# EAGLE design fm-radio (EAGLE 6.5.0)
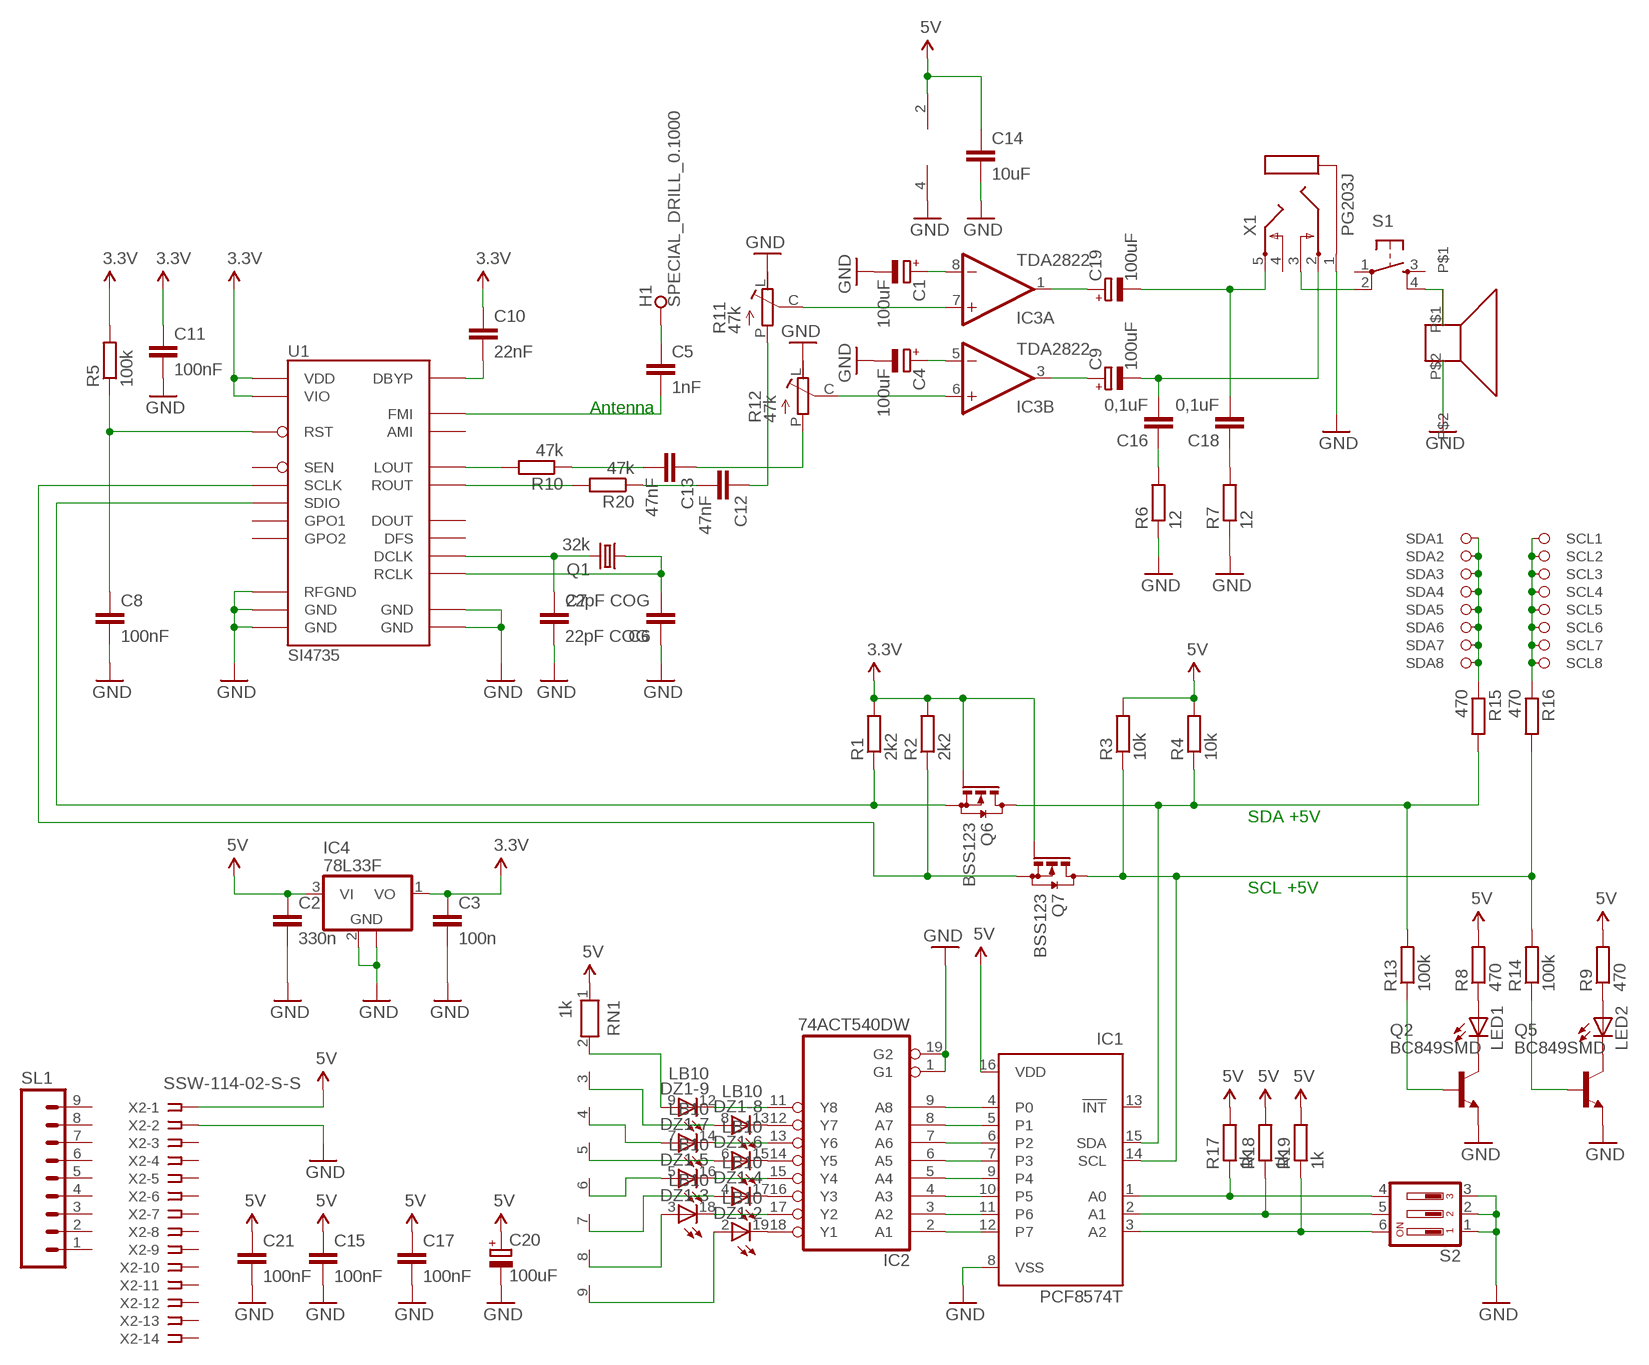
[diagram p0: schematic, sheet 1]

## Parts
C1  100uF  CPOL-EUCT3528  [CT3528]
C2  330n  C-EUC1206  [C1206]
C3  100n  C-EUC1206  [C1206]
C4  100uF  CPOL-EUCT3528  [CT3528]
C5  1nF  C-EUC1206  [C1206]
C6  22pF COG  C-EUC1206  [C1206]
C7  22pF COG  C-EUC1206  [C1206]
C8  100nF  C-EUC1206  [C1206]
C9  100uF  CPOL-EUCT3528  [CT3528]
C10  22nF  C-EUC1206  [C1206]
C11  100nF  C-EUC1206  [C1206]
C12  47nF  C-EUC1206  [C1206]
C13  47nF  C-EUC1206  [C1206]
C14  10uF  C-EUC1206  [C1206]
C15  100nF  C-EUC1206  [C1206]
C16  0,1uF  C-EUC1206  [C1206]
C17  100nF  C-EUC1206  [C1206]
C18  0,1uF  C-EUC1206  [C1206]
C19  100uF  CPOL-EUCT3528  [CT3528]
C20  100uF  CPOL-EUCT3528  [CT3528]
C21  100nF  C-EUC1206  [C1206]
DZ1  LB10  [LB10]
H1  SPECIAL_DRILL_0.1000  [PAD_0.1000]
IC1  PCF8574T  [SO16W]
IC2  74ACT540DW  [SO20W]
IC3  TDA2822  L272D  [SO08]
IC4  78L33F  78L05F  [SOT89]
LED1  LEDCHIPLED_1206  [CHIPLED_1206]
LED2  LEDCHIPLED_1206  [CHIPLED_1206]
Q1  32k  MC-306  [MC-306]
Q2  BC849SMD  [SOT23-BEC]
Q5  BC849SMD  [SOT23-BEC]
Q6  BSS123  [SOT23]
Q7  BSS123  [SOT23]
R1  2k2  R-EU_R1206  [R1206]
R2  2k2  R-EU_R1206  [R1206]
R3  10k  R-EU_R1206  [R1206]
R4  10k  R-EU_R1206  [R1206]
R5  100k  R-EU_R1206  [R1206]
R6  12  R-EU_R1206  [R1206]
R7  12  R-EU_R1206  [R1206]
R8  470  R-EU_R1206  [R1206]
R9  470  R-EU_R1206  [R1206]
R10  47k  R-EU_R1206  [R1206]
R11  47k  TRIMER  [TRIMER]
R12  47k  TRIMER  [TRIMER]
R13  100k  R-EU_R1206  [R1206]
R14  100k  R-EU_R1206  [R1206]
R15  470  R-EU_R1206  [R1206]
R16  470  R-EU_R1206  [R1206]
R17  1k  R-EU_R1206  [R1206]
R18  1k  R-EU_R1206  [R1206]
R19  1k  R-EU_R1206  [R1206]
R20  47k  R-EU_R1206  [R1206]
RN1  1k  RN08  [RN-9]
S1  TAC_SWITCHPTH  [TACTILE-PTH]
S2  DIP03YL  [DIP03YL]
SL1  M09  [09P]
U1  SI4735  [SSOP24_NARROW]
U$1  K23PC  [K23PC]
U$7  PATICE_I2C  [PATICE_I2C]
X1  PG203J  [PG203J]
X2  SSW-114-02-S-S  [SSW-114-02-S-S]

## Nets
3.3V: C3.1 C10.1 C11.1 IC4.1(VO) Q6.1(G) Q7.1(G) R1.2 R2.2 R5.2 U1.20(VIO) U1.21(VDD)
5V: C2.1 C14.1 C15.1 C17.1 C20.+ C21.1 IC1.16(VDD) IC3.2(P:V+) IC4.3(VI) R3.2 R4.2 R8.2 R9.2 R17.2 R18.2 R19.2 RN1.1 X2.1
GND: C1.- C2.2 C3.2 C4.- C6.1 C7.2 C8.2 C11.2 C14.2 C15.2 C17.2 C20.- C21.2 IC1.8(VSS) IC2.1(G1) IC2.19(G2) IC3.4(P:GND) IC4.2(GND) IC4.2@1(GND) Q2.E Q5.E R6.1 R7.1 R11.L R12.L S2.1 S2.2 S2.3 U1.9(RFGND) U1.10(GND) U1.11(GND) U1.13(GND) U1.14(GND) U$1.P$2 X1.1 X2.2
N$1: IC1.15(SDA) Q6.3(D) R4.1 R13.2 R15.2
N$2: R16.1 U$7.SCL_1(SCL1) U$7.SCL_2(SCL2) U$7.SCL_3(SCL3) U$7.SCL_4(SCL4) U$7.SCL_5(SCL5) U$7.SCL_6(SCL6) U$7.SCL_7(SCL7) U$7.SCL_8(SCL8)
N$3: Q7.2(S) R2.1 U1.17(SCLK)
N$4: IC3.7(A:+IN) R11.C
N$5: Q6.2(S) R1.1 U1.18(SDIO)
N$6: C5.2 U1.8(FMI)
N$7: C5.1 H1.1
N$8: C7.1 Q1.4 U1.3(DCLK)
N$9: C13.1 R12.P
N$10: C8.1 R5.1 U1.15(RST)
N$11: S1.2 X1.3
N$12: C1.+ IC3.8(A:-IN)
N$13: C6.2 Q1.1 U1.19(RCLK)
N$14: C10.2 U1.22(DBYP)
N$15: C12.1 R11.P
N$16: S1.4 U$1.P$1
N$17: C4.+ IC3.5(B:-IN)
N$18: IC3.6(B:+IN) R12.C
N$19: C16.1 R6.2
N$20: C9.- C16.2 X1.2
N$21: C18.1 R7.2
N$22: C18.2 C19.- X1.5
N$23: C19.+ IC3.1(A:OUT)
N$24: C9.+ IC3.3(B:OUT)
N$25: LED1.C Q2.C
N$26: LED2.C Q5.C
N$27: LED1.A R8.1
N$28: LED2.A R9.1
N$29: Q2.B R13.1
N$30: Q5.B R14.1
N$31: R15.1 U$7.SDA_1(SDA1) U$7.SDA_2(SDA2) U$7.SDA_3(SDA3) U$7.SDA_4(SDA4) U$7.SDA_5(SDA5) U$7.SDA_6(SDA6) U$7.SDA_7(SDA7) U$7.SDA_8(SDA8)
N$32: IC1.14(SCL) Q7.3(D) R3.1 R14.2 R16.2
N$33: IC1.4(P0) IC2.9(A8)
N$34: IC1.12(P7) IC2.2(A1)
N$35: IC1.11(P6) IC2.3(A2)
N$36: IC1.10(P5) IC2.4(A3)
N$37: IC1.9(P4) IC2.5(A4)
N$38: IC1.7(P3) IC2.6(A5)
N$39: IC1.6(P2) IC2.7(A6)
N$40: IC1.5(P1) IC2.8(A7)
N$41: DZ1.12(-9:C) IC2.11(Y8)
N$42: DZ1.13(-8:C) IC2.12(Y7)
N$43: DZ1.14(-7:C) IC2.13(Y6)
N$44: DZ1.15(-6:C) IC2.14(Y5)
N$45: DZ1.16(-5:C) IC2.15(Y4)
N$46: DZ1.17(-4:C) IC2.16(Y3)
N$47: DZ1.18(-3:C) IC2.17(Y2)
N$48: DZ1.19(-2:C) IC2.18(Y1)
N$49: DZ1.9(-9:A) RN1.2
N$50: DZ1.8(-8:A) RN1.3
N$51: DZ1.7(-7:A) RN1.4
N$52: DZ1.6(-6:A) RN1.5
N$53: DZ1.5(-5:A) RN1.6
N$54: DZ1.4(-4:A) RN1.7
N$55: DZ1.3(-3:A) RN1.8
N$56: DZ1.2(-2:A) RN1.9
N$57: IC1.1(A0) R17.1 S2.4
N$58: IC1.2(A1) R18.1 S2.5
N$59: IC1.3(A2) R19.1 S2.6
N$61: R10.2 U1.24(LOUT)
N$62: C12.2 R20.1
N$63: C13.2 R10.1
N$64: R20.2 U1.23(ROUT)
Unconnected: DZ1.1(-1:A) DZ1.10(-10:A) DZ1.11(-10:C) DZ1.20(-1:C) IC1.13(!INT) S1.1 S1.3 SL1.1 SL1.2 SL1.3 SL1.4 SL1.5 SL1.6 SL1.7 SL1.8 SL1.9 U1.1(DOUT) U1.2(DFS) U1.4(GPO2) U1.5(GPO1) U1.12(AMI) U1.16(SEN) X1.4 X2.3 X2.4 X2.5 X2.6 X2.7 X2.8 X2.9 X2.10 X2.11 X2.12 X2.13 X2.14

## Notes on the sheet
- Antenna
- SDA +5V
- SCL +5V

## Power pins joined to a net without a drawn wire
GND: IC2.10(GND)
VCC: IC2.20(VCC)

## Library data of the parts
C1 C4 C9 C19 C20 = rcl:CPOL-EU: POLARIZED CAPACITOR, European symbol
C2 C3 C5-C8 C10-C18 C21 = rcl:C-EU: CAPACITOR, European symbol
DZ1 = led:LB10: LED BLOCK 10-LED bar graph, DIL, Siemens
H1 = special-drill:SPECIAL_DRILL_: Special drills
IC1 = micro-philips:PCF8574: I2C-Bus Remote 8-bit I/O expander http://www.semiconductors.philips.com/acrobat_download/datasheets/PCF8574_4.pdf; MPN: PCF8574T/3,512; OC_FARNELL: 1201255; OC_NEWARK: 70R6870
IC2 = 74xx-eu:74*540: Octal BUFFER and LINE DRIVER, 3-state
IC3 = linear:L272: OP AMP
IC4 = linear:78L*: POSITOIV-VOLTAGE REGULATORS Output up to 100 mA Source: http://focus.ti.com/lit/ds/symlink/ua78l05.pdf
LED1 LED2 = led:LED: LED OSRAM: - CHIPLED LG R971, LG N971, LY N971, LG Q971, LY Q971, LO R971, LY R971 LH N974, LH R974 LS Q976, LO Q976, LY Q976 LO Q996 - Hyper CHIPLED LW Q18S LB Q993, LB Q99A, LB R99A - SideLED LS A670, LO A670, LY A670, LG A670, LP A670 LB A673, LV A673, LT A673, LW A673 LH A674 LY A675 LS A676, LA A676, LO A676, LY A676, LW A676 LS A679, LY A679, LG A679 - Hyper Micro SIDELED® LS Y876, LA Y876, LO Y876, LY Y876 LT Y87S - SmartLED LW L88C, LW L88S LB L89C, LB L89S, LG L890 LS L89K, LO L89K, LY L89K LS L896, LA L896, LO L896, LY L896 - TOPLED LS T670, LO T670, LY T670, LG T670, LP T670 LSG T670, LSP T670, LSY T670, LOP T670, LYG T670 LG T671, LOG T671, LSG T671 LB T673, LV T673, LT T673, LW T673 LH T674 LS T676, LA T676, LO T676, LY T676, LB T676, LH T676, LSB T676, LW T676 LB T67C, LV T67C, LT T67C, LS T67K, LO T67K, LY T67K, LW E67C LS E67B, LA E67B, LO E67B, LY E67B, LB E67C, LV E67C, LT E67C LW T67C LS T679, LY T679, LG T679 LS T770, LO T770, LY T770, LG T770, LP T770 LB T773, LV T773, LT T773, LW T773 LH T774 LS E675, LA E675, LY E675, LS T675 LS T776, LA T776, LO T776, LY T776, LB T776 LHGB T686 LT T68C, LB T68C - Hyper Mini TOPLED® LB M676 - Mini TOPLED Santana® LG M470 LS M47K, LO M47K, LY M47K Source: http://www.osram.convergy.de LUXEON: - LUMILED® LXK2-PW12-R00, LXK2-PW12-S00, LXK2-PW14-U00, LXK2-PW14-V00 LXK2-PM12-R00, LXK2-PM12-S00, LXK2-PM14-U00 LXK2-PE12-Q00, LXK2-PE12-R00, LXK2-PE12-S00, LXK2-PE14-T00, LXK2-PE14-U00 LXK2-PB12-K00, LXK2-PB12-L00, LXK2-PB12-M00, LXK2-PB14-N00, LXK2-PB14-P00, LXK2-PB14-Q00 LXK2-PR12-L00, LXK2-PR12-M00, LXK2-PR14-Q00, LXK2-PR14-R00 LXK2-PD12-Q00, LXK2-PD12-R00, LXK2-PD12-S00 LXK2-PH12-R00, LXK2-PH12-S00 LXK2-PL12-P00, LXK2-PL12-Q00, LXK2-PL12-R00 Source: www.luxeon.com KINGBRIGHT: KA-3528ASYC Source: www.kingbright.com
Q1 = crystal:MC-306: kHz RANGE CRYSTAL UNIT SMD Source: MC-306_405_406_E07X.PDF Homepage <http://www.epsontoyocom.co.jp>; MPN: MC-306 60.0KHZ 100PPM ,12.5PF; OC_FARNELL: 1278040; OC_NEWARK: 31M5576
Q2 Q5 = transistor-npn:BC849*: NPN Transistor
Q6 Q7 = transistor-small-signal:BSS123: N-CHANNEL MOS FET
R1-R10 R13-R20 = rcl:R-EU_: RESISTOR, European symbol
R11 R12 = kit:TRIMER
RN1 = resistor-net:RN08: RESISTOR NETWORK; OC_FARNELL: unknown; OC_NEWARK: unknown
S1 = SparkFun:TAC_SWITCH: Momentary Switch Button commonly used for reset or general input. Spark Fun Electronics SKU : COM-00097
S2 = switch-dil:DIP03YL: DIL/CODE SWITCH; OC_FARNELL: unknown; OC_NEWARK: unknown
SL1 = con-amp-quick:M09: AMP QUICK CONNECTOR; OC_FARNELL: unknown; OC_NEWARK: unknown
U1 = SparkFun:SI4735: Radio chip that covers FM broadcast with RDS, plus a bunch of shortwave and logwave frequencies
U$1 = SparkFun:K23PC
U$7 = kit:PATICE_I2C
X1 = con-hirschmann:PG203J: MIC/HEADPHONE JACK KS-S stereo microphone/headphone jack PG203JN (Schukat); OC_FARNELL: unknown; OC_NEWARK: unknown
X2 = con-samtec:SSW-114-02-S-S: THROUGH-HOLE .025" SQ POST SOCKET Source: Samtec SSW.pdf; MPN: SSW-114-02-S-S; OC_FARNELL: unknown; OC_NEWARK: 11P9549

## Board
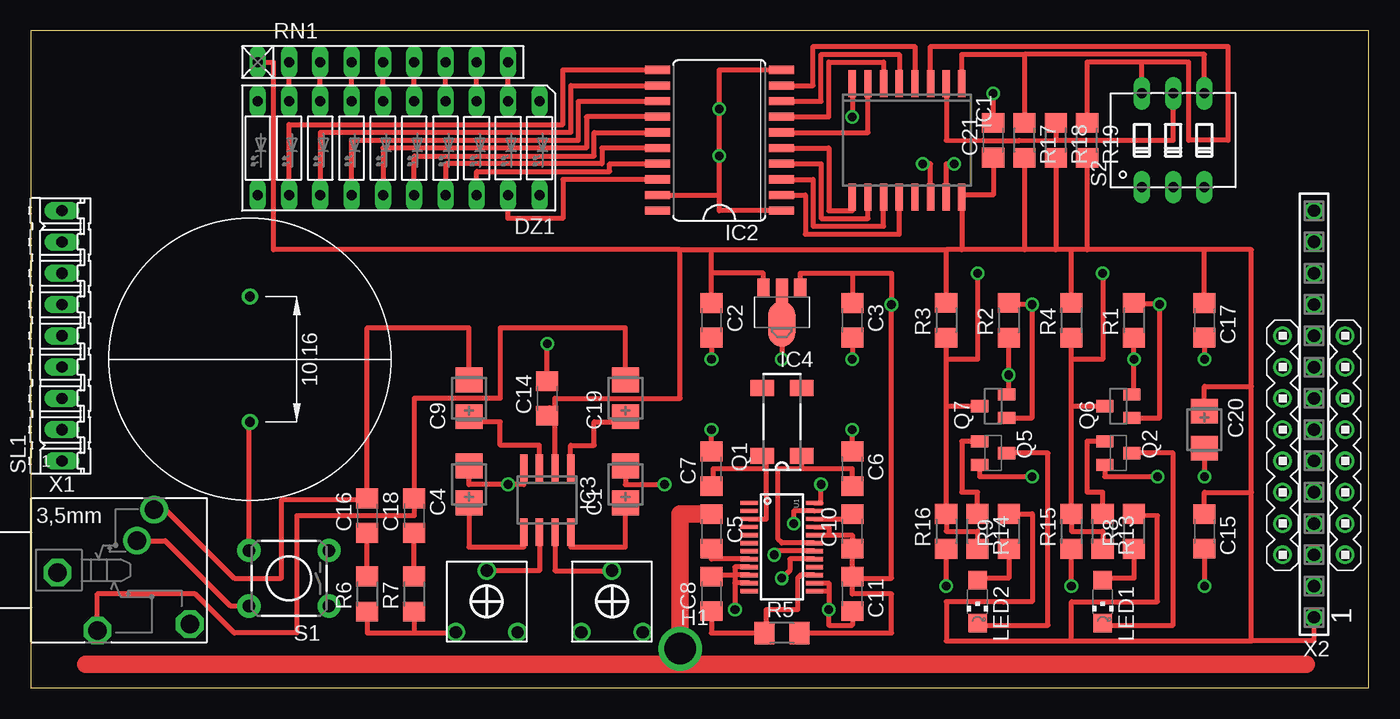
[diagram p1: board, top side]
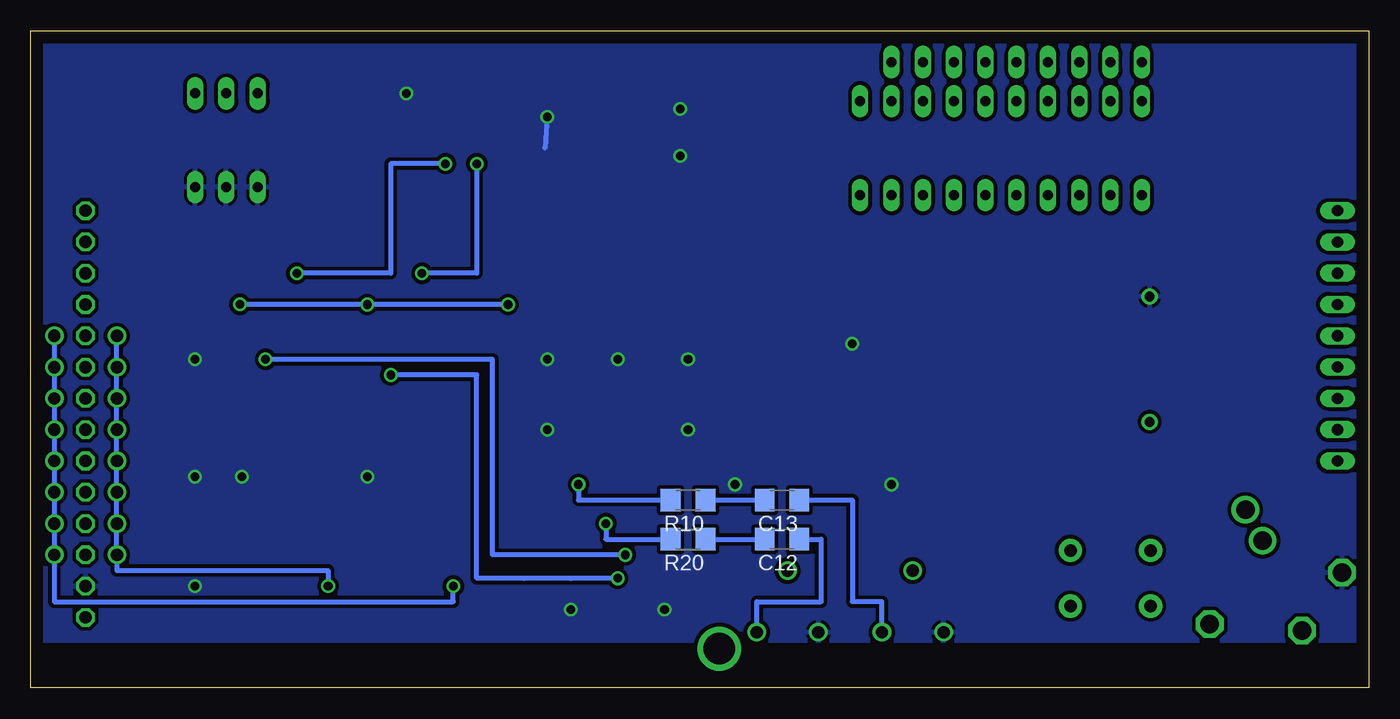
[diagram p2: board, bottom side, seen from below]

Size 108.59 x 53.34 mm. Coordinates in mm from the lower left corner, seen from the top.
Outline: 0,0 108.59,0 108.59,53.34 0,53.34 0,0
Copper layers (1*16): Top 0.035mm / dielectric 1.5mm / Bottom 0.035mm
Design rules "default": minimum track width 10mil, minimum drill 24mil, track to track 8mil, track to pad 8mil, pad to pad 8mil, via to via 8mil, smd to smd 8mil, copper to edge 40mil, drill to drill 8mil, minimum pad ring 10mil, minimum via ring 8mil, stop-mask expansion 4mil, vias tented up to drill 0mil, thermal gap 10mil

### Footprints (pad centres in the part's own frame; a part is rotated, then mirrored left to right if it is on the bottom)
CT3528 = smd 2 x 2.2: + -1.5,0; - 1.5,0
C1206 = smd 1.6 x 1.8: 1 -1.4,0; 2 1.4,0
LB10 = drill 0.813 long: 1 -11.43,-3.81; 2 -8.89,-3.81; 3 -6.35,-3.81; 4 -3.81,-3.81; 5 -1.27,-3.81; 6 1.27,-3.81; 7 3.81,-3.81; 8 6.35,-3.81; 9 8.89,-3.81; 10 11.43,-3.81; 11 11.43,3.81; 12 8.89,3.81; 13 6.35,3.81; 14 3.81,3.81; 15 1.27,3.81; 16 -1.27,3.81; 17 -3.81,3.81; 18 -6.35,3.81; 19 -8.89,3.81; 20 -11.43,3.81
PAD_0.1000 = drill 2.54 pad 2.54: 1 0,0
SO16W = smd 0.6 x 2.2: 1 -4.445,-4.6; 2 -3.175,-4.6; 3 -1.905,-4.6; 4 -0.635,-4.6; 5 0.635,-4.6; 6 1.905,-4.6; 7 3.175,-4.6; 8 4.445,-4.6; 9 4.445,4.6; 10 3.175,4.6; 11 1.905,4.6; 12 0.635,4.6; 13 -0.635,4.6; 14 -1.905,4.6; 15 -3.175,4.6; 16 -4.445,4.6
SO20W = smd 0.66 x 2.032: 1 -5.715,-5.029; 2 -4.445,-5.029; 3 -3.175,-5.029; 4 -1.905,-5.029; 5 -0.635,-5.029; 6 0.635,-5.029; 7 1.905,-5.029; 8 3.175,-5.029; 9 4.445,-5.029; 10 5.715,-5.029; 11 5.715,5.029; 12 4.445,5.029; 13 3.175,5.029; 14 1.905,5.029; 15 0.635,5.029; 16 -0.635,5.029; 17 -1.905,5.029; 18 -3.175,5.029; 19 -4.445,5.029; 20 -5.715,5.029
SO08 = smd 0.6 x 2.2: 1 -1.905,-2.6; 2 -0.635,-2.6; 3 0.635,-2.6; 4 1.905,-2.6; 5 1.905,2.6; 6 0.635,2.6; 7 -0.635,2.6; 8 -1.905,2.6
SOT89 = smd 1 x 1.5: 1 -1.499,-1.981; 3 1.499,-1.981 | smd 1 x 2: 2 0,-1.727 | smd 2.2 x 3.7: 2@1 0,0.94
CHIPLED_1206 = smd 1.5 x 1.5: A 0,-1.75; C 0,1.75
MC-306 = smd 1.3 x 1.9: 1 -2.75,-1.6; 2 2.75,-1.6; 3 2.75,1.6; 4 -2.75,1.6
SOT23-BEC = smd 1 x 1.4: B -0.95,-1.1; C 0,1.1; E 0.95,-1.1
SOT23 = smd 1 x 1.4: 1 -0.95,-1.1; 2 0.95,-1.1; 3 0,1.1
R1206 = smd 1.6 x 1.803: 1 -1.422,0; 2 1.422,0
TRIMER = drill 1: C 0,2.5; L -2.5,-2.5; P 2.5,-2.5
RN-9 = drill 0.813 long: 1 -10.16,0; 2 -7.62,0; 3 -5.08,0; 4 -2.54,0; 5 0,0; 6 2.54,0; 7 5.08,0; 8 7.62,0; 9 10.16,0
TACTILE-PTH = drill 1.016 pad 1.88: 1 -3.251,2.261; 2 3.251,2.261; 3 -3.251,-2.261; 4 3.251,-2.261
DIP03YL = drill 0.813 long: 1 -2.54,-3.81; 2 0,-3.81; 3 2.54,-3.81; 4 2.54,3.81; 5 0,3.81; 6 -2.54,3.81
09P = drill 0.914 long: 1 -10.16,0; 2 -7.62,0; 3 -5.08,0; 4 -2.54,0; 5 0,0; 6 2.54,0; 7 5.08,0; 8 7.62,0; 9 10.16,0
SSOP24_NARROW = smd 0.348 x 1.397: 1 -3.575,-2.65; 2 -2.925,-2.65; 3 -2.275,-2.65; 4 -1.625,-2.65; 5 -0.975,-2.65; 6 -0.325,-2.65; 7 0.325,-2.65; 8 0.975,-2.65; 9 1.625,-2.65; 10 2.275,-2.65; 11 2.925,-2.65; 12 3.575,-2.65; 13 3.575,2.65; 14 2.925,2.65; 15 2.275,2.65; 16 1.625,2.65; 17 0.975,2.65; 18 0.325,2.65; 19 -0.325,2.65; 20 -0.975,2.65; 21 -1.625,2.65; 22 -2.275,2.65; 23 -2.925,2.65; 24 -3.575,2.65
K23PC = drill 0.8: P$1 0,-5.08; P$2 0,5.08
PATICE_I2C = drill 1: SCL_1 -2.54,8.89; SCL_2 -2.54,6.35; SCL_3 -2.54,3.81; SCL_4 -2.54,1.27; SCL_5 -2.54,-1.27; SCL_6 -2.54,-3.81; SCL_7 -2.54,-6.35; SCL_8 -2.54,-8.89; SDA_1 2.54,8.89; SDA_2 2.54,6.35; SDA_3 2.54,3.81; SDA_4 2.54,1.27; SDA_5 2.54,-1.27; SDA_6 2.54,-3.81; SDA_7 2.54,-6.35; SDA_8 2.54,-8.89
PG203J = drill 1.499 octagon: 1 -5.004,-0.203; 4 5.74,-4.369; 5 -1.753,-4.902 | drill 1.499: 2 2.845,4.902; 3 1.448,2.388
SSW-114-02-S-S = drill 1 pad 1.5 octagon: 1 -16.51,0; 2 -13.97,0; 3 -11.43,0; 4 -8.89,0; 5 -6.35,0; 6 -3.81,0; 7 -1.27,0; 8 1.27,0; 9 3.81,0; 10 6.35,0; 11 8.89,0; 12 11.43,0; 13 13.97,0; 14 16.51,0

### Placement (x,y rotation side)
C1  48.26,16.51 90 top
C2  55.24,29.84 270 top
C3  66.67,29.84 270 top
C4  35.56,16.51 90 top
C5  55.24,12.7 270 top
C6  66.67,17.78 270 top
C7  55.24,17.78 90 top
C8  55.24,7.62 90 top
C9  35.56,23.5 90 top
C10  66.67,12.7 90 top
C11  66.67,7.62 270 top
C12  47.62,12.06 180 bottom
C13  47.62,15.24 180 bottom
C14  41.91,23.5 90 top
C15  95.25,12.7 270 top
C16  27.3,13.97 90 top
C17  95.25,29.84 270 top
C18  31.11,13.97 90 top
C19  48.26,23.5 90 top
C20  95.25,20.95 270 top
C21  78.11,44.45 90 top
DZ1  29.84,43.81 180 top
H1  52.7,3.17 0 top
IC1  71.12,44.45 180 top
IC2  55.88,44.45 90 top
IC3  41.91,15.24 180 top
IC4  60.96,30.48 180 top
LED1  87,6.99 180 top
LED2  76.84,6.99 180 top
Q1  60.96,21.59 90 top
Q2  88.27,19.05 270 top
Q5  78.11,19.05 270 top
Q6  88.27,22.86 90 top
Q7  78.11,22.86 90 top
R1  89.54,29.84 90 top
R2  79.38,29.84 90 top
R3  74.3,29.84 90 top
R4  84.45,29.84 90 top
R5  60.96,4.45 0 top
R6  27.3,7.62 90 top
R7  31.11,7.62 90 top
R8  89.54,12.7 90 top
R9  79.38,12.7 90 top
R10  55.24,15.24 180 bottom
R11  47.17,7.01 0 top
R12  37.01,7.01 0 top
R13  87,12.7 270 top
R14  76.84,12.7 270 top
R15  84.45,12.7 90 top
R16  74.3,12.7 90 top
R17  80.65,44.45 270 top
R18  83.19,44.45 270 top
R19  85.73,44.45 270 top
R20  55.24,12.06 180 bottom
RN1  28.57,50.8 0 top
S1  20.96,8.89 180 top
S2  92.71,44.45 0 top
SL1  2.54,28.57 90 top
U1  60.96,11.43 270 top
U$1  17.78,26.67 0 top
U$7  104.14,19.68 180 top
X1  7.16,9.55 0 top
X2  104.14,22.23 90 top

### Tracks (layer width: path | path; a pad name or v marks a point on that pad's centre or on a via)
3.3V  (via drill 0.7)
  Top 0.406: 66.67,33.66 C3.1 | 66.67,33.66 69.85,33.66 v69.85,31.11 69.85,8.89 66.67,8.89 C11.1 | Q7.1 81.28,21.91 v81.28,31.11 79.38,31.11 R2.2 | R5.2 69.85,4.45 69.85,7.62 66.67,7.62 C11.1 | C11.1 C10.1 66.67,12.4 U1.20 64.77,12.4 64.77,13.05 U1.21 | Q6.1 91.62,21.91 v91.62,31.14 89.54,31.14 R1.2 | IC4.1 62.46,33.66 66.67,33.66
  Bottom 0.406: v69.85,31.11 v81.28,31.11 91.62,31.11 v91.62,31.14
5V
  Top 0.406: 52.7,35.56 19.68,35.56 19.68,50.8 RN1.1 | 52.7,35.56 55.24,35.56 | 55.24,35.56 74.3,35.56 | 84.45,3.81 99.06,3.81 | X2.1 104.14,3.81 99.06,3.81 | 75.56,35.56 IC1.16 75.56,40.01 78.11,40.01 C21.1 | R19.2 85.73,35.56 | R18.2 83.19,35.56 | R17.2 80.65,35.56 | 80.65,35.56 75.56,35.56 | 99.06,3.81 99.06,15.88 | 99.06,15.88 99.06,24.47 | 99.06,24.47 99.06,35.56 95.25,35.56 | 95.25,35.56 85.73,35.56 | 85.73,35.56 84.45,35.56 | 84.45,35.56 83.19,35.56 | 83.19,35.56 80.65,35.56 | R9.2 81.28,14.12 81.28,6.99 arc-1 74.3,6.99 74.3,3.81 84.45,3.81 | 84.45,3.81 84.45,6.99 91.44,6.99 91.44,13.97 89.71,13.99 R8.2 | R3.2 74.3,35.56 | R4.2 84.45,35.56 | C2.1 55.24,33.66 | 55.24,33.66 55.24,35.56 | 42.54,22.23 arc10 42.09,22.75 C14.1 42.54,22.75 | 42.54,22.75 42.54,23.5 52.7,23.5 52.7,35.56 | C15.1 95.25,15.88 99.06,15.88 | C17.1 95.25,35.56 | C20.+ 95.25,24.47 99.06,24.47 | IC3.2 42.54,22.23 | 42.54,22.23 42.54,22.75 | 55.24,33.66 59.46,33.66 IC4.3 | 75.56,35.56 74.3,35.56
GND  (via drill 0.7)
  Top 0.406: IC2.19 55.88,40.01 | 55.88,40.01 v55.88,43.18 v55.88,46.99 55.88,50.16 IC2.10 | 60.96,38.73 IC2.1 55.88,38.73 55.88,40.01 | IC1.8 v66.67,46.35 | C8.2 55.56,9.18 57.15,9.18 | C2.2 v55.24,26.67 | C6.1 66.85,19.07 66.67,19.05 v66.67,20.95 | Q5.E 77.01,17.14 v81.28,17.14 | Q2.E 87.17,17.14 v91.44,17.14 | R6.1 27.3,4.45 31.11,4.45 | R7.1 31.11,4.45 | IC3.4 40,16.51 v38.73,16.51 35.56,16.51 C4.- | C14.2 v41.91,27.94 | C17.2 v95.25,26.67 | C15.2 v95.25,8.26 | C20.- v95.25,17.14 | C21.2 v78.11,48.26 | C1.- 48.26,16.51 v51.43,16.51 | C7.2 55.42,19.07 55.24,19.05 v55.24,20.95 | 31.11,4.45 34.44,4.45 arc90 R12.L | C11.2 66.67,5.08 64.77,5.08 v64.77,6.35 64.77,7.86 | U1.9 57.15,9.8 57.15,9.18 | 57.15,9.15 57.15,8.51 | 57.15,8.51 v57.15,6.35 | 57.15,9.18 57.15,9.15 | U1.10 57.15,9.15 | U1.11 57.15,8.51 | U1.14 64.77,8.51 64.77,7.86 | U1.13 64.77,7.86 | 60.96,32.38 IC4.2 IC4.2@1 v60.96,26.67 | C3.2 v66.67,26.67
  Bottom 0.406: v66.67,46.35 66.85,43.84
  pour Bottom (isolate 0.305): 0,52.7 0,3.81 108.59,3.81 108.59,52.7
N$1  (via drill 0.7)
  Top 0.406: 84.45,22.86 R15.2 84.45,12.7 87,12.7 R13.2 | 84.45,22.86 Q6.3 | 84.45,22.86 84.45,26.67 | 84.45,26.67 R4.1 | IC1.15 74.3,42.55 v74.93,42.55 | v87,33.66 87,26.67 84.45,26.67
  Bottom 0.406: v74.93,42.55 79.38,42.55 79.38,33.66 v87,33.66
N$2  (via drill 0.7)
  Top 0.406: v74.3,8.26 R16.1
  Bottom 0.406: U$7.SCL_8 U$7.SCL_7 U$7.SCL_6 U$7.SCL_5 U$7.SCL_4 U$7.SCL_3 U$7.SCL_2 U$7.SCL_1 106.68,6.99 74.3,6.99 v74.3,8.26
N$3  (via drill 0.7)
  Top 0.406: Q7.2 79.38,24.13 v79.38,25.4 R2.1 | U1.17 61.6,10.46 61.6,9.53 v60.96,8.89
  Bottom 0.406: v60.96,8.89 arc1 72.39,8.89 72.39,25.4 v79.38,25.4
N$4
  Top 0.406: R11.C 42.54,9.51 IC3.7
N$5  (via drill 0.7)
  Top 0.406: Q6.2 89.54,24.13 v89.54,26.67 R1.1 | U1.18 60.32,11.11 v60.32,10.79
  Bottom 0.406: v60.32,10.79 71.12,10.79 71.12,26.67 v89.54,26.67
N$6
  Top 0.406: U1.8 55.24,10.46 C5.2
N$7
  Top 1.27: 52.7,1.91 H1.1
  Top 1.422: C5.1 52.7,14.1 H1.1 | 103.51,1.91 52.7,1.91 4.45,1.91
N$8
  Top 0.406: C7.1 55.42,16.38 55.39,16.38 55.39,17.78 59.69,17.78 | U1.3 59.69,13.71 59.69,17.78 | 59.69,17.78 59.69,18.84 Q1.4
N$9
  Bottom 0.406: C13.1 41.91,15.24 41.91,6.99 39.51,6.99 R12.P
N$10
  Top 0.406: R5.1 55.24,4.45 C8.1 | 59.69,3.81 R5.1 | U1.15 62.49,9.15 62.23,8.89 62.23,6.35 59.69,6.35 59.69,3.96 arc-90 R5.1
N$11
  Top 0.406: S1.2 16.23,6.63 10.92,11.94 X1.3
N$12
  Top 0.406: IC3.8 43.81,11.43 48.26,11.43 C1.+
N$13
  Top 0.406: C6.2 66.67,17.78 62.56,17.78 | U1.19 60.96,11.75 60.64,12.06 60.64,17.78 62.56,17.78 | Q1.1 62.56,17.78
N$14
  Top 0.406: U1.22 66.67,13.71 C10.2
N$15
  Bottom 0.406: R11.P 49.67,6.99 44.45,6.99 44.45,12.06 C12.1
N$16
  Top 0.406: S1.4 17.7,21.59 U$1.P$1
N$17
  Top 0.406: C4.+ 35.56,11.43 40,11.43 IC3.5
N$18
  Top 0.406: R12.C 41.27,9.51 IC3.6
N$19
  Top 0.406: R6.2 C16.1
N$20
  Top 0.406: C9.- 35.56,29.21 27.3,29.21 C16.2 27.3,15.24 20.32,15.24 20.32,8.89 16.51,8.89 10.95,14.45 X1.2
N$21
  Top 0.406: R7.2 C18.1
N$22
  Top 0.406: C19.- 48.26,29.21 38.1,29.21 38.1,23.5 31.11,23.5 C18.2 31.11,13.97 21.59,13.97 21.59,4.45 16.51,4.45 13.34,7.62 5.41,7.62 X1.5
N$23
  Top 0.406: IC3.1 43.81,19.68 45.72,19.68 45.72,21.59 48.26,21.59 C19.+
N$24
  Top 0.406: C9.+ 35.56,21.59 38.1,21.59 38.1,19.68 41.27,19.68 IC3.3
N$25
  Top 0.406: LED1.C 87,5.08 92.71,5.08 92.71,19.05 Q2.C
N$26
  Top 0.406: LED2.C 76.84,5.08 82.55,5.08 82.55,19.05 Q5.C
N$27
  Top 0.406: R8.1 89.54,8.89 87,8.89 LED1.A
N$28
  Top 0.406: R9.1 79.38,8.89 76.84,8.89 LED2.A
N$29
  Top 0.406: Q2.B 85.73,20 85.73,15.88 87,15.88 R13.1
N$30
  Top 0.406: Q5.B 75.56,20 75.56,15.88 76.84,15.88 R14.1
N$31  (via drill 0.7)
  Top 0.406: v84.45,8.26 R15.1
  Bottom 0.406: U$7.SDA_8 U$7.SDA_7 U$7.SDA_6 U$7.SDA_5 U$7.SDA_4 U$7.SDA_3 U$7.SDA_2 U$7.SDA_1 101.6,9.53 84.45,9.53 v84.45,8.26
N$32  (via drill 0.7)
  Top 0.406: 74.3,22.86 R16.2 74.3,12.7 76.84,12.7 R14.2 | 74.3,22.86 Q7.3 | 74.3,22.86 74.3,26.67 | 74.3,26.67 R3.1 | IC1.14 73.03,42.55 v72.39,42.55 | v76.84,33.66 76.84,26.67 74.3,26.67
  Bottom 0.406: v72.39,42.55 72.39,33.66 v76.84,33.66
N$33
  Top 0.406: IC1.4 71.76,52.07 63.5,52.07 63.5,48.9 IC2.9
N$34
  Top 0.406: IC1.12 70.48,36.83 62.87,36.83 62.87,40.01 IC2.2
N$35
  Top 0.406: IC1.11 69.22,37.47 63.5,37.47 63.5,41.27 IC2.3
N$36
  Top 0.406: IC1.10 67.95,38.1 64.14,38.1 64.14,42.55 IC2.4
N$37
  Top 0.406: IC1.9 66.67,38.73 64.77,38.73 64.77,43.81 IC2.5
N$38
  Top 0.406: IC2.6 67.95,45.09 IC1.7
N$39
  Top 0.406: IC1.6 69.22,50.8 64.77,50.8 64.77,46.35 IC2.7
N$40
  Top 0.406: IC1.5 70.48,51.44 64.14,51.44 64.14,47.62 IC2.8
N$41
  Top 0.406: DZ1.12 20.96,45.72 43.18,45.72 43.18,50.16 IC2.11
N$42
  Top 0.406: IC2.12 43.81,48.9 43.81,45.09 23.5,45.09 DZ1.13
N$43
  Top 0.406: DZ1.14 26.04,44.45 44.45,44.45 44.45,47.62 IC2.13
N$44
  Top 0.406: IC2.14 45.08,46.35 45.08,43.81 28.57,43.81 DZ1.15
N$45
  Top 0.406: DZ1.16 31.11,43.18 45.72,43.18 45.72,45.09 IC2.15
N$46
  Top 0.406: IC2.16 46.35,43.81 46.35,42.55 33.65,42.55 DZ1.17
N$47
  Top 0.406: DZ1.18 36.2,41.91 46.99,41.91 46.99,42.55 IC2.17
N$48
  Top 0.406: IC2.18 43.18,41.27 43.18,38.1 38.73,38.1 DZ1.19
N$49
  Top 0.406: DZ1.9 RN1.2
N$50
  Top 0.406: DZ1.8 RN1.3
N$51
  Top 0.406: DZ1.7 RN1.4
N$52
  Top 0.406: DZ1.6 RN1.5
N$53
  Top 0.406: DZ1.5 RN1.6
N$54
  Top 0.406: DZ1.4 RN1.7
N$55
  Top 0.406: DZ1.3 RN1.8
N$56
  Top 0.406: DZ1.2 RN1.9
N$57
  Top 0.406: IC1.1 75.56,51.44 80.65,51.44 | 80.65,51.44 R17.1 | S2.4 95.25,51.44 80.65,51.44
N$58
  Top 0.406: IC1.2 74.3,44.45 arc1 83.19,44.45 | R18.1 83.19,44.45 | 83.19,44.45 92.71,44.45 S2.5
N$59
  Top 0.406: IC1.3 73.03,52.07 97.16,52.07 97.16,44.45 93.98,44.45 93.98,50.8 90.17,50.8 | 90.17,50.8 85.73,50.8 R19.1 | S2.6 90.17,50.8
N$61  (via drill 0.7)
  Top 0.406: U1.24 64.14,15.01 v64.14,16.51
  Bottom 0.406: v64.14,16.51 64.14,15.24 R10.2
N$62
  Bottom 0.406: R20.1 C12.2
N$63
  Bottom 0.406: R10.1 C13.2
N$64  (via drill 0.7)
  Top 0.406: U1.23 61.91,14.36 v61.91,13.34
  Bottom 0.406: v61.91,13.34 61.91,12.06 R20.2

### Text on the board
tTest: PCF8574 | A2 | A1 | A0 | Log0 | LED7 | LED0 | Log1 | C7 | ...................... | C0 | SDA | SCL | REPRO | SDA | SCL | Head Phones | Si4735
200bmp: /tmp/logo_katedra_informatiky2.bmp | /tmp/logo_katedra_informatiky2.bmp